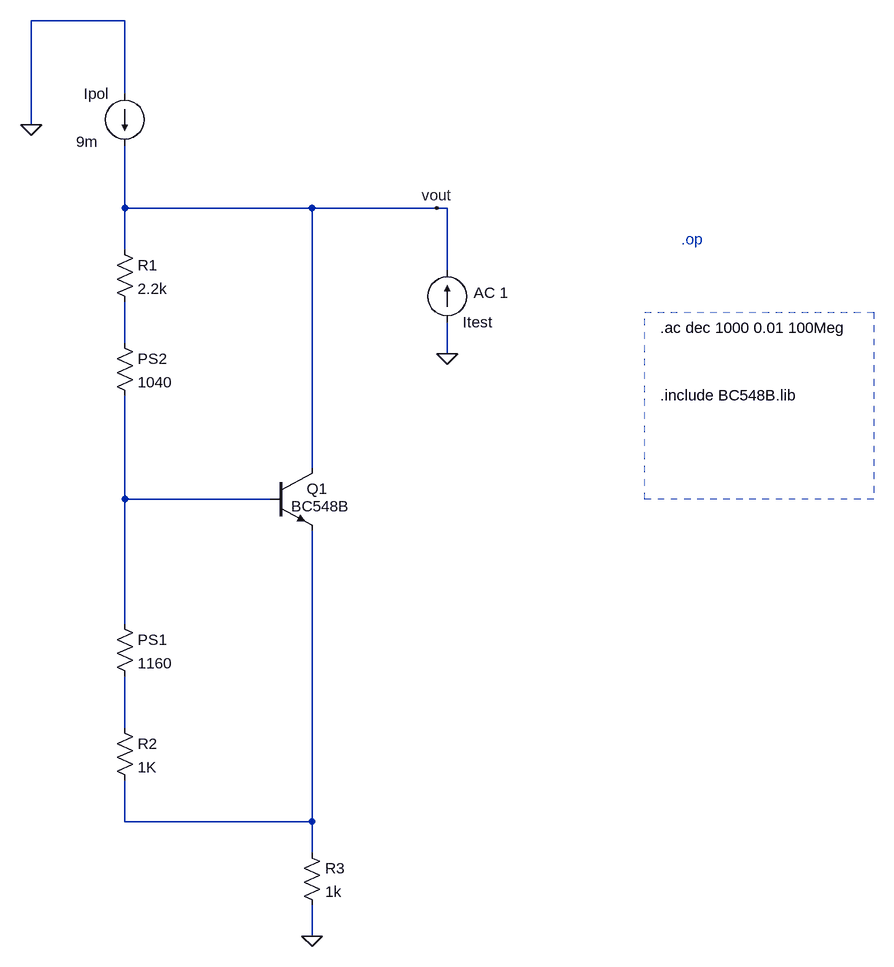
[diagram p0: schematic VBE_multiplier.asc]
VBE_multiplier.asc, the LTspice schematic file:
Version 4
SHEET 1 1140 916
WIRE -16 -512 -160 -512
WIRE -16 -400 -16 -512
WIRE -160 -352 -160 -512
WIRE -16 -224 -16 -320
WIRE 272 -224 -16 -224
WIRE 464 -224 272 -224
WIRE 480 -224 464 -224
WIRE -16 -160 -16 -224
WIRE 480 -128 480 -224
WIRE -16 -16 -16 -80
WIRE 480 0 480 -48
WIRE 272 176 272 -224
WIRE -16 224 -16 64
WIRE 208 224 -16 224
WIRE -16 416 -16 224
WIRE -16 576 -16 496
WIRE -16 720 -16 656
WIRE 272 720 272 272
WIRE 272 720 -16 720
WIRE 272 768 272 720
WIRE 272 896 272 848
FLAG -160 -352 0
FLAG 480 0 0
FLAG 464 -224 vout
FLAG 272 896 0
DATAFLAG 160 -224 ""
DATAFLAG 144 224 ""
SYMBOL res -32 -176 R0
SYMATTR InstName R1
SYMATTR Value 2.2k
SYMBOL res -32 400 R0
SYMATTR InstName PS1
SYMATTR Value 1160
SYMBOL res -32 560 R0
SYMATTR InstName R2
SYMATTR Value 1K
SYMBOL npn 208 176 R0
WINDOW 3 32 59 Left 2
SYMATTR Value BC548B
SYMATTR InstName Q1
SYMBOL res -32 -32 R0
SYMATTR InstName PS2
SYMATTR Value 1040
SYMBOL current -16 -400 M0
WINDOW 123 41 46 Left 2
WINDOW 39 0 0 Left 0
WINDOW 3 41 74 Left 2
SYMATTR InstName Ipol
SYMATTR Value 9m
SYMBOL current 480 -48 M180
WINDOW 123 41 46 Left 2
WINDOW 39 0 0 Left 0
SYMATTR Value2 AC 1
SYMATTR InstName Itest
SYMATTR Value ""
SYMBOL res 256 752 R0
SYMATTR InstName R3
SYMATTR Value 1k
TEXT 840 -176 Left 2 ;.op
TEXT 808 64 Left 2 !.include BC548B.lib
TEXT 808 -40 Left 2 !.ac dec 1000 0.01 100Meg
RECTANGLE Normal 1136 224 784 -64 1

The netlist it stands for:
* VBE_multiplier.asc
R1 vout N001 2.2k
R§PS1 N002 N003 1160
R2 N003 N004 1K
Q1 vout N002 N004 0 BC548B
R§PS2 N001 N002 1040
Ipol 0 vout 9m
Itest 0 vout AC 1
R3 N004 0 1k
.model NPN NPN
.model PNP PNP
.lib standard.bjt
* .op
.include BC548B.lib
.ac dec 1000 0.01 100Meg
.backanno
.end